# EAGLE schematic zeropi (EAGLE 7.5.0)

## Sheet 1 of 3: MCU
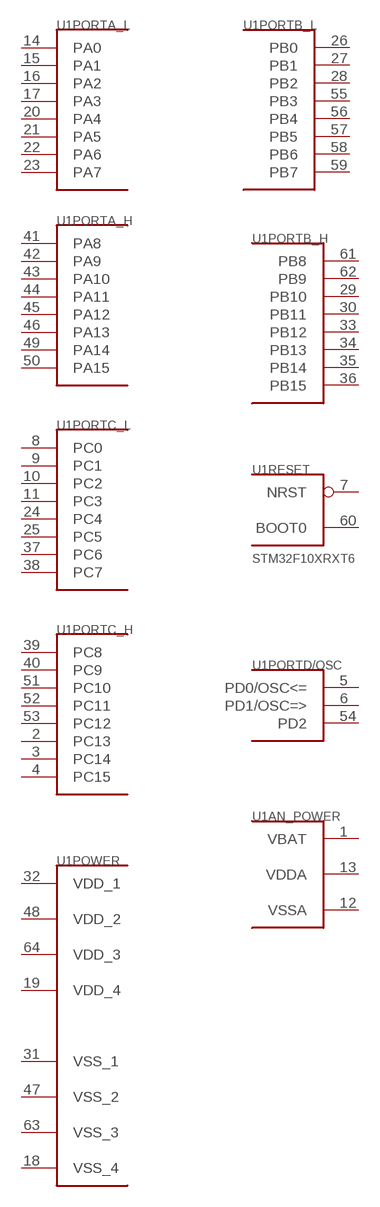
[diagram p0: schematic, sheet 1]

### Parts
U1  STM32F10XRXT6  [TQFP64]
Unconnected: U1.2(PORTC_H:PC13) U1.3(PORTC_H:PC14) U1.4(PORTC_H:PC15) U1.5(PORTD/OSC:PD0/OSC<=) U1.6(PORTD/OSC:PD1/OSC=>) U1.7(RESET:NRST) U1.8(PORTC_L:PC0) U1.9(PORTC_L:PC1) U1.10(PORTC_L:PC2) U1.11(PORTC_L:PC3) U1.14(PORTA_L:PA0) U1.15(PORTA_L:PA1) U1.16(PORTA_L:PA2) U1.17(PORTA_L:PA3) U1.20(PORTA_L:PA4) U1.21(PORTA_L:PA5) U1.22(PORTA_L:PA6) U1.23(PORTA_L:PA7) U1.24(PORTC_L:PC4) U1.25(PORTC_L:PC5) U1.26(PORTB_L:PB0) U1.27(PORTB_L:PB1) U1.28(PORTB_L:PB2) U1.29(PORTB_H:PB10) U1.30(PORTB_H:PB11) U1.33(PORTB_H:PB12) U1.34(PORTB_H:PB13) U1.35(PORTB_H:PB14) U1.36(PORTB_H:PB15) U1.37(PORTC_L:PC6) U1.38(PORTC_L:PC7) U1.39(PORTC_H:PC8) U1.40(PORTC_H:PC9) U1.41(PORTA_H:PA8) U1.42(PORTA_H:PA9) U1.43(PORTA_H:PA10) U1.44(PORTA_H:PA11) U1.45(PORTA_H:PA12) U1.46(PORTA_H:PA13) U1.49(PORTA_H:PA14) U1.50(PORTA_H:PA15) U1.51(PORTC_H:PC10) U1.52(PORTC_H:PC11) U1.53(PORTC_H:PC12) U1.54(PORTD/OSC:PD2) U1.55(PORTB_L:PB3) U1.56(PORTB_L:PB4) U1.57(PORTB_L:PB5) U1.58(PORTB_L:PB6) U1.59(PORTB_L:PB7) U1.60(RESET:BOOT0) U1.61(PORTB_H:PB8) U1.62(PORTB_H:PB9)

## Sheet 2 of 3: power
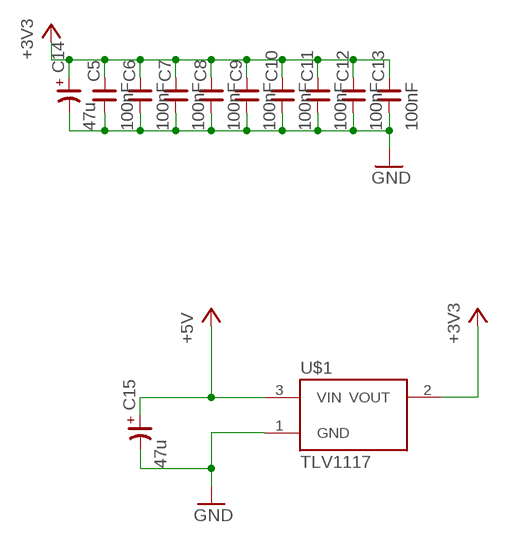
[diagram p1: schematic, sheet 2]

### Parts
C5  100nF  CNP-0805  [0805]
C6  100nF  CNP-0805  [0805]
C7  100nF  CNP-0805  [0805]
C8  100nF  CNP-0805  [0805]
C9  100nF  CNP-0805  [0805]
C10  100nF  CNP-0805  [0805]
C11  100nF  CNP-0805  [0805]
C12  100nF  CNP-0805  [0805]
C13  100nF  CNP-0805  [0805]
C14  47u  CP-153CLV-1012  [153CLV-1012]
C15  47u  CP-153CLV-1012  [153CLV-1012]
U$1  TLV1117  [SOT223]

### Nets
+3V3: C5.2 C6.2 C7.2 C8.2 C9.2 C10.2 C11.2 C12.2 C13.2 C14.+ U$1.2(VOUT) U$1.4(VOUT2)
+5V: C15.+ U$1.3(VIN) ; also sheet 3
GND: C5.1 C6.1 C7.1 C8.1 C9.1 C10.1 C11.1 C12.1 C13.1 C14.- C15.- U$1.1(GND) ; also sheet 3

## Sheet 3 of 3: usb
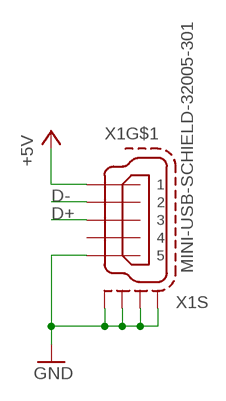
[diagram p2: schematic, sheet 3]

### Parts
X1  MINI-USB-SCHIELD-32005-301  [32005-301]

### Nets
+5V: X1.1 ; also sheet 2
D+: X1.3
D-: X1.2
GND: X1.5 X1.M1(S:S1) X1.M2(S:S2) X1.M3(S:S3) X1.M4(S:S4) ; also sheet 2
Unconnected: X1.4

## Power pins joined to a net without a drawn wire
VBAT: U1.1(AN_POWER:VBAT)
VDD_1: U1.32(POWER:VDD_1)
VDD_2: U1.48(POWER:VDD_2)
VDD_3: U1.64(POWER:VDD_3)
VDD_4: U1.19(POWER:VDD_4)
VDDA: U1.13(AN_POWER:VDDA)
VSS_1: U1.31(POWER:VSS_1)
VSS_2: U1.47(POWER:VSS_2)
VSS_3: U1.63(POWER:VSS_3)
VSS_4: U1.18(POWER:VSS_4)
VSSA: U1.12(AN_POWER:VSSA)

## Library data of the parts
C5-C13 = cap-master:CNP-: NON-POLARIZED CAP
C14 C15 = cap-master:CP-: POLARIZED CAP
U1 = stm32:STM32F10XRXT6: STM32F101/103 64pin LQFP
U$1 = stm32_usbserial:TLV1117
X1 = con-cypressindustries:MINI-USB-SCHIELD-: MINI USB-B Conector Source: www.cypressindustries.com; OC_FARNELL: unknown; OC_NEWARK: unknown